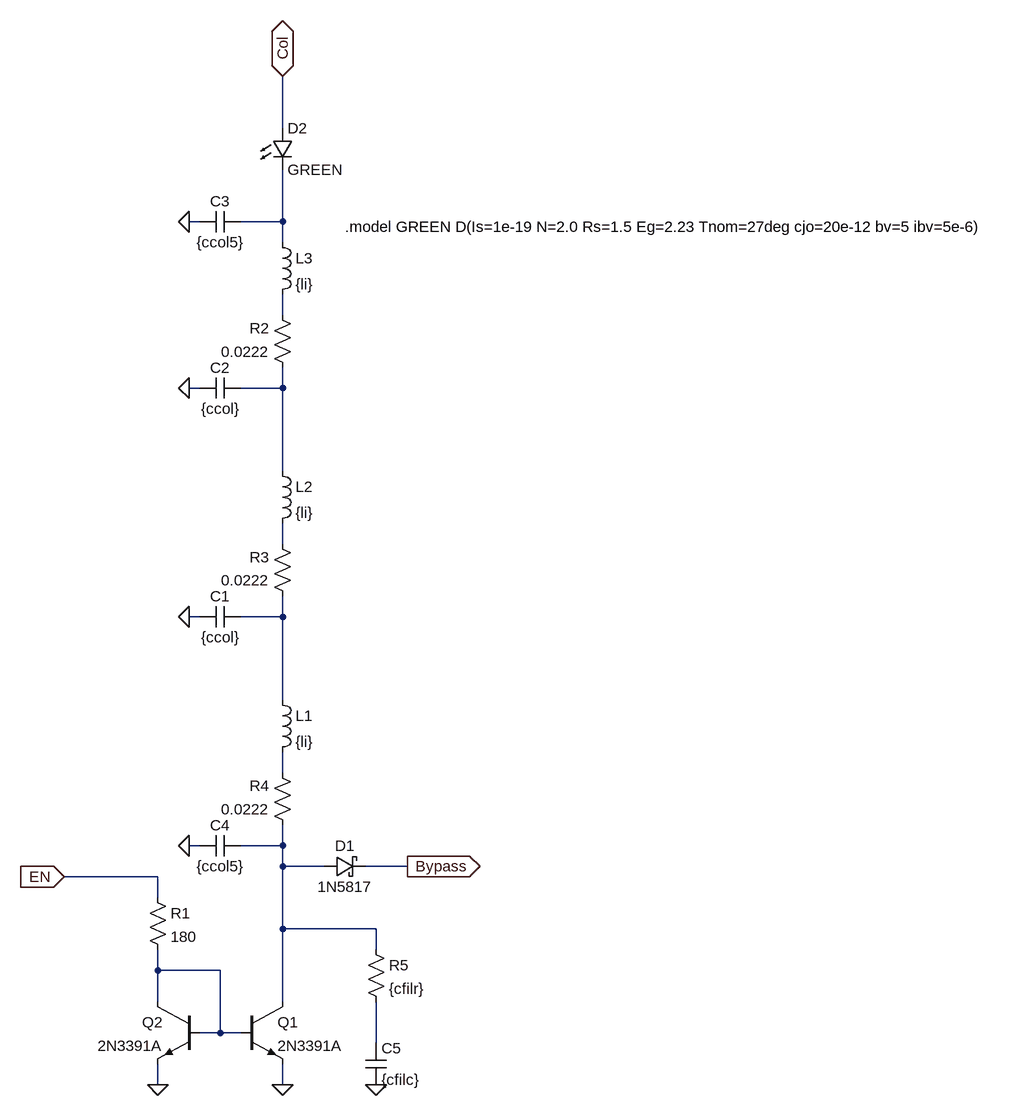
[diagram p0: schematic ColDrv.asc]
ColDrv.asc, the LTspice schematic file:
Version 4
SHEET 1 1624 1008
WIRE 384 -1152 384 -1232
WIRE 256 -1008 240 -1008
WIRE 384 -1008 384 -1088
WIRE 384 -1008 320 -1008
WIRE 384 -976 384 -1008
WIRE 384 -864 384 -896
WIRE 256 -752 240 -752
WIRE 384 -752 384 -784
WIRE 384 -752 320 -752
WIRE 384 -624 384 -752
WIRE 384 -512 384 -544
WIRE 256 -400 240 -400
WIRE 384 -400 384 -432
WIRE 384 -400 320 -400
WIRE 384 -272 384 -400
WIRE 384 -160 384 -192
WIRE 256 -48 240 -48
WIRE 384 -48 384 -80
WIRE 384 -48 320 -48
WIRE 384 -16 384 -48
WIRE 448 -16 384 -16
WIRE 576 -16 512 -16
WIRE 192 0 48 0
WIRE 192 32 192 0
WIRE 384 80 384 -16
WIRE 528 80 384 80
WIRE 528 112 528 80
WIRE 192 144 192 112
WIRE 288 144 192 144
WIRE 192 192 192 144
WIRE 384 192 384 80
WIRE 288 240 288 144
WIRE 288 240 256 240
WIRE 320 240 288 240
WIRE 528 256 528 192
WIRE 192 320 192 288
WIRE 384 320 384 288
FLAG 384 320 0
FLAG 192 320 0
FLAG 240 -1008 0
FLAG 240 -752 0
FLAG 240 -400 0
FLAG 240 -48 0
FLAG 48 0 EN
IOPIN 48 0 In
FLAG 576 -16 Bypass
IOPIN 576 -16 Out
FLAG 528 320 0
FLAG 384 -1232 Col
IOPIN 384 -1232 BiDir
SYMBOL npn 320 192 R0
SYMATTR InstName Q1
SYMATTR Value 2N3391A
SYMBOL npn 256 192 M0
SYMATTR InstName Q2
SYMATTR Value 2N3391A
SYMBOL res 176 16 R0
SYMATTR InstName R1
SYMATTR Value 180
SYMBOL schottky 448 0 R270
WINDOW 0 32 32 VTop 2
WINDOW 3 0 32 VBottom 2
SYMATTR InstName D1
SYMATTR Value 1N5817
SYMATTR Description Diode
SYMATTR Type diode
SYMBOL res 400 -768 R180
WINDOW 0 36 76 Left 2
WINDOW 3 36 40 Left 2
SYMATTR InstName R2
SYMATTR Value 0.0222
SYMBOL res 400 -416 R180
WINDOW 0 36 76 Left 2
WINDOW 3 36 40 Left 2
SYMATTR InstName R3
SYMATTR Value 0.0222
SYMBOL res 400 -64 R180
WINDOW 0 36 76 Left 2
WINDOW 3 36 40 Left 2
SYMATTR InstName R4
SYMATTR Value 0.0222
SYMBOL cap 320 -416 R90
WINDOW 0 0 32 VBottom 2
WINDOW 3 32 32 VTop 2
SYMATTR InstName C1
SYMATTR Value {ccol}
SYMBOL cap 320 -768 R90
WINDOW 0 0 32 VBottom 2
WINDOW 3 32 32 VTop 2
SYMATTR InstName C2
SYMATTR Value {ccol}
SYMBOL cap 320 -1024 R90
WINDOW 0 0 32 VBottom 2
WINDOW 3 32 32 VTop 2
SYMATTR InstName C3
SYMATTR Value {ccol5}
SYMBOL cap 320 -64 R90
WINDOW 0 0 32 VBottom 2
WINDOW 3 32 32 VTop 2
SYMATTR InstName C4
SYMATTR Value {ccol5}
SYMBOL ind 368 -288 R0
SYMATTR InstName L1
SYMATTR Value {li}
SYMBOL ind 368 -640 R0
SYMATTR InstName L2
SYMATTR Value {li}
SYMBOL ind 368 -992 R0
SYMATTR InstName L3
SYMATTR Value {li}
SYMBOL LED 368 -1152 R0
SYMATTR InstName D2
SYMATTR Value GREEN
SYMATTR Description Diode
SYMATTR Type diode
SYMBOL res 512 96 R0
SYMATTR InstName R5
SYMATTR Value {cfilr}
SYMBOL cap 512 256 R0
SYMATTR InstName C5
SYMATTR Value {cfilc}
TEXT 480 -1000 Left 2 !.model GREEN D(Is=1e-19 N=2.0 Rs=1.5 Eg=2.23 Tnom=27deg cjo=20e-12 bv=5 ibv=5e-6)

The netlist it stands for:
* ColDrv.asc
Q1 N007 N008 0 0 2N3391A
Q2 N008 N008 0 0 2N3391A
R1 EN N008 180
D1 N007 Bypass 1N5817
R2 N003 N002 0.0222
R3 N005 N004 0.0222
R4 N007 N006 0.0222
C1 N005 0 {ccol}
C2 N003 0 {ccol}
C3 N001 0 {ccol5}
C4 N007 0 {ccol5}
L1 N005 N006 {li}
L2 N003 N004 {li}
L3 N001 N002 {li}
D2 Col N001 GREEN
R5 N007 N009 {cfilr}
C5 N009 0 {cfilc}
.model D D
.lib standard.dio
.model NPN NPN
.model PNP PNP
.lib standard.bjt
.model GREEN D(Is=1e-19 N=2.0 Rs=1.5 Eg=2.23 Tnom=27deg cjo=20e-12 bv=5 ibv=5e-6)
.backanno
.end